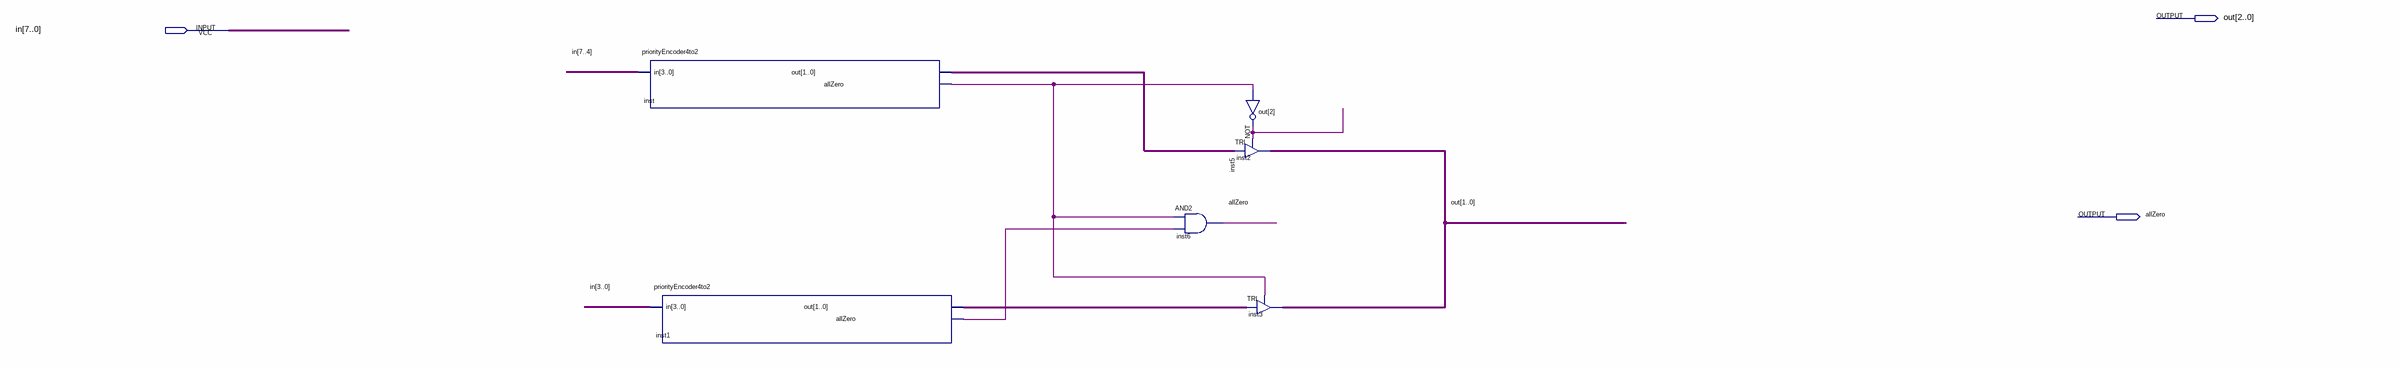
[diagram p0: schematic sheet]
// Quartus schematic priorityEncoder8to3.bdf as structural Verilog: 6 symbols, 3 pins
module priorityEncoder8to3 (
  input  [7:0] in,
  output [2:0] out,
  output allZero
);

  wire inst1_allzero, inst_allzero;
  wire [1:0] inst1_out, inst_out;

  priorityEncoder4to2 inst (.in(in[7:4]), .out(inst_out), .allZero(inst_allzero));
  priorityEncoder4to2 inst1 (.in(in[3:0]), .out(inst1_out), .allZero(inst1_allzero));
  and inst6 (allZero, inst_allzero, inst1_allzero);
  not inst5 (out[2], inst_allzero);
  TRI inst2[1:0] (.IN(inst_out), .OE(out[2]), .OUT(out[1:0]));
  TRI inst3[1:0] (.IN(inst1_out), .OE(inst_allzero), .OUT(out[1:0]));
endmodule
